# EasyEDA schematic voltage_regulator.json
TITLE: Voltage Regulator Using 7805; REV: 1.0; Date: 2022-07-14; Sheet: 1/1; Company: Symbiosis Institute of Technology
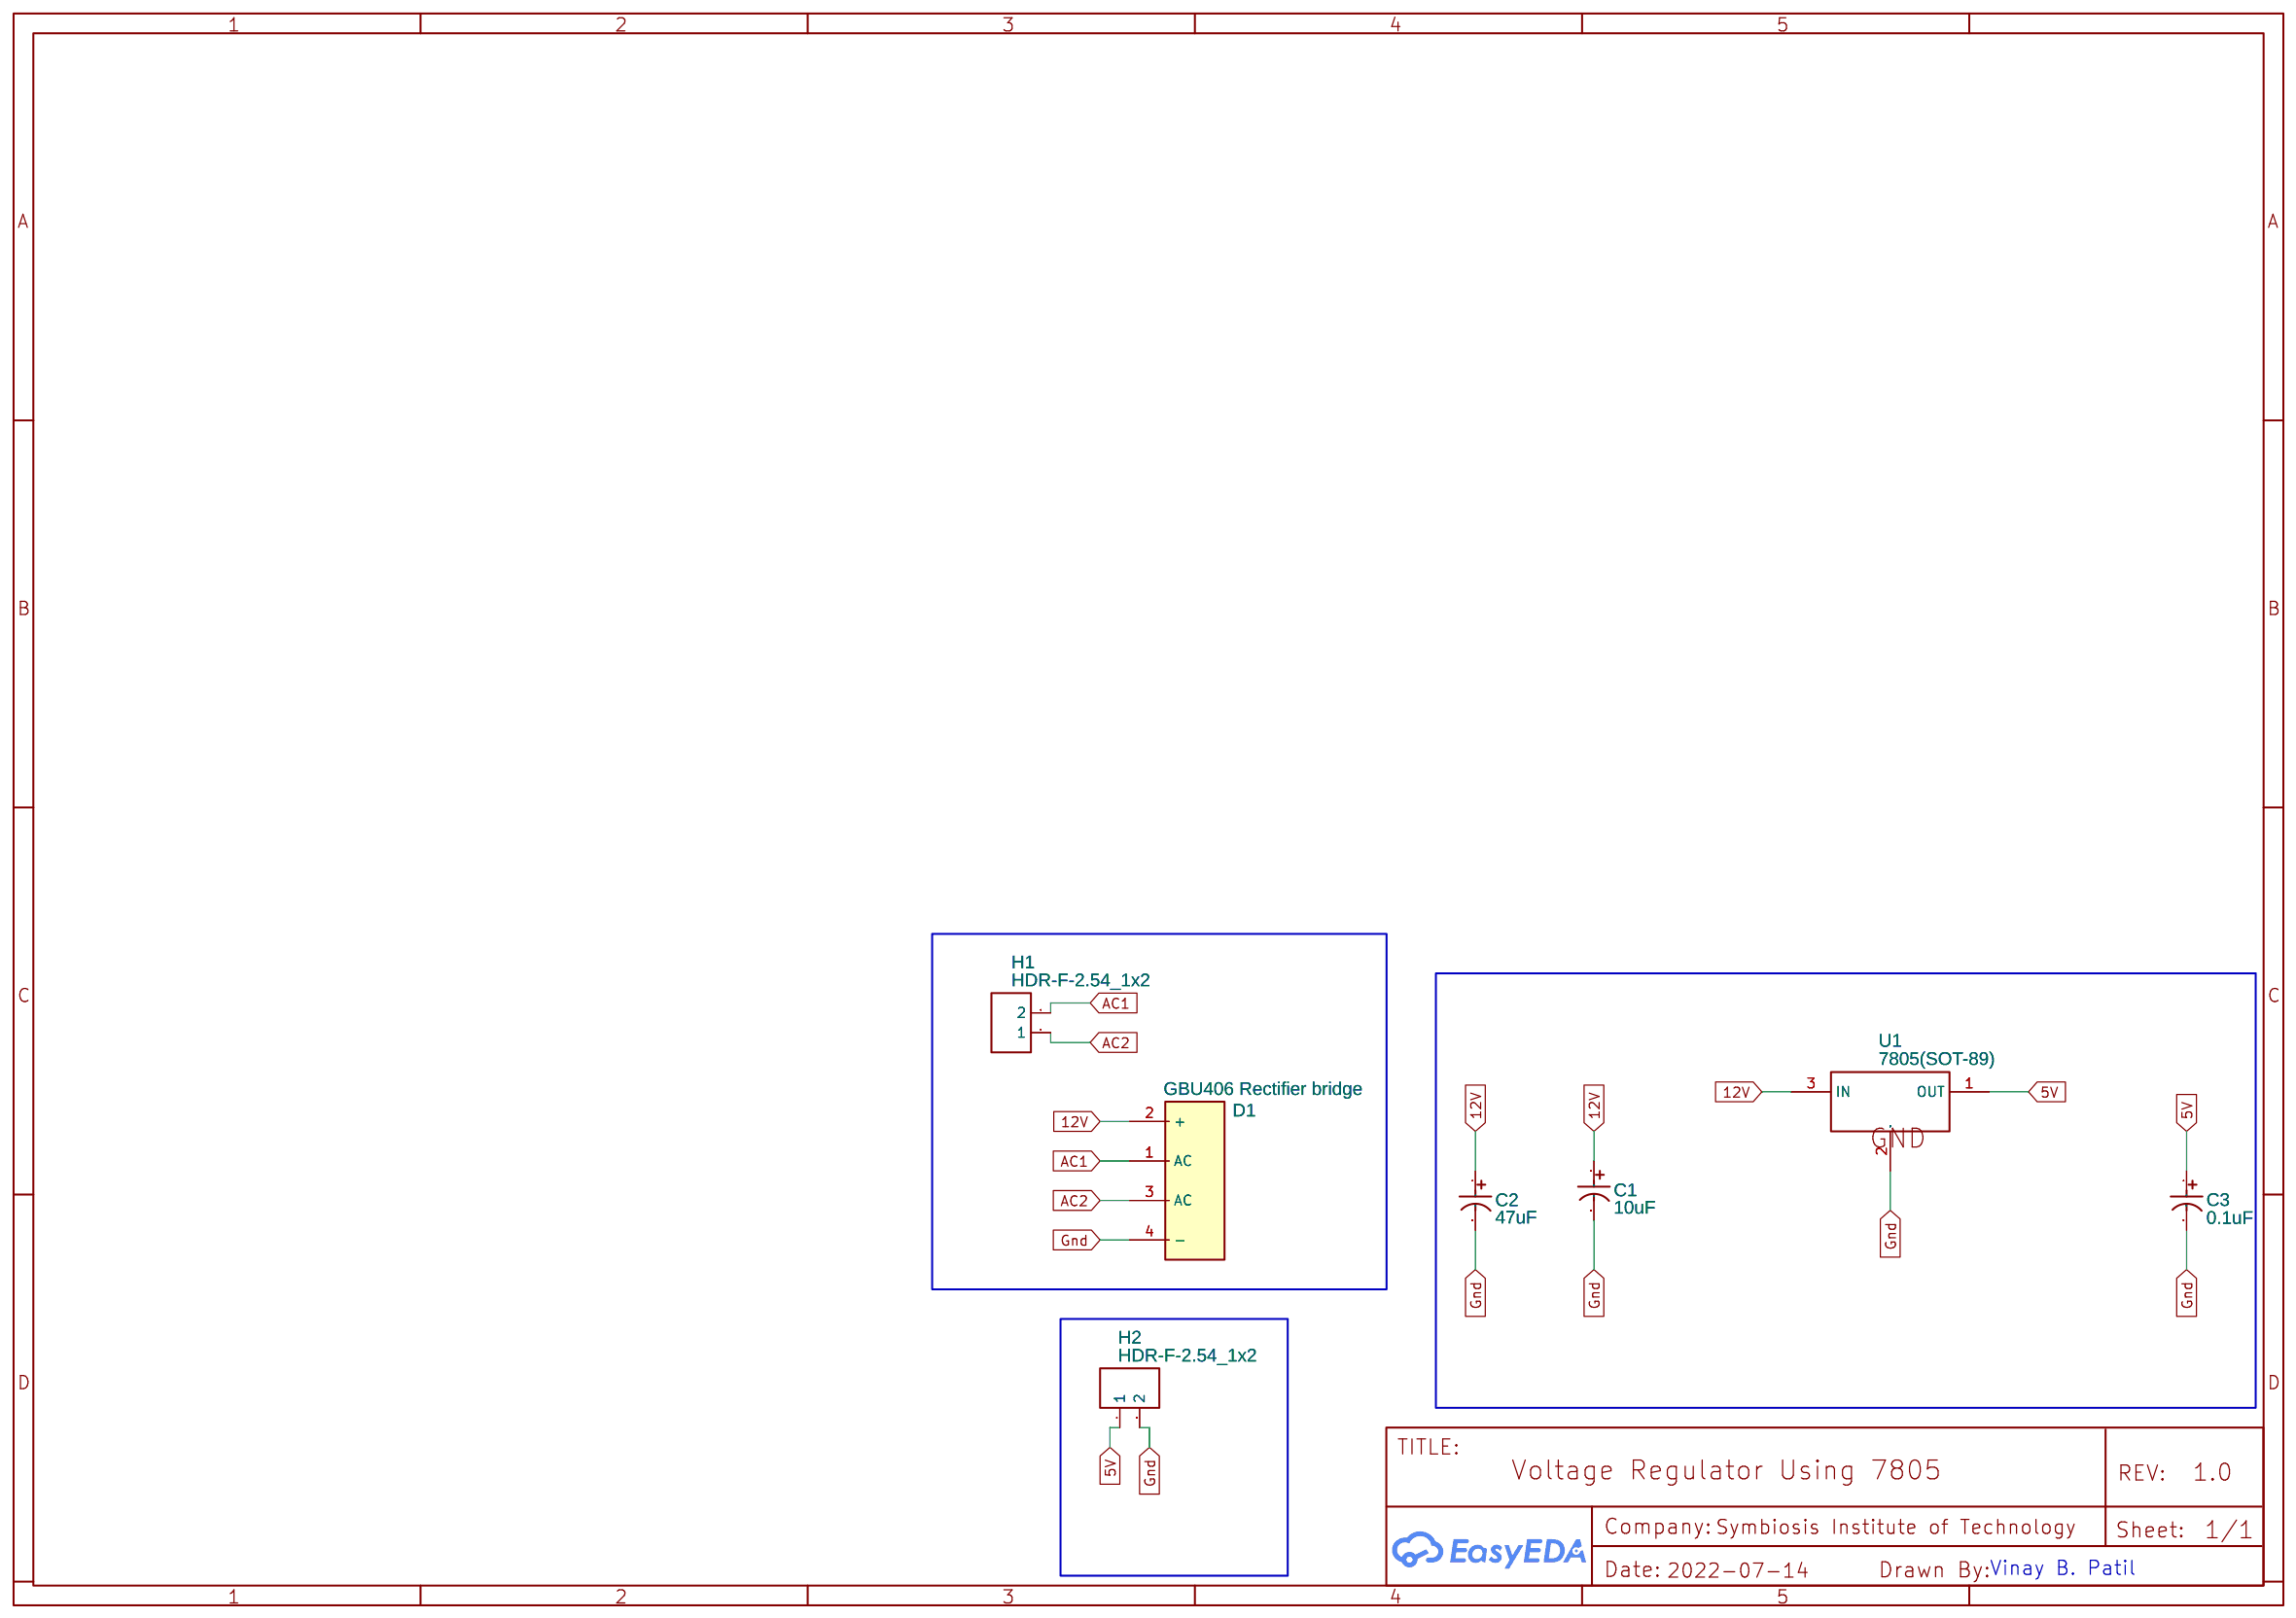
[diagram p0: schematic sheet]

## Parts
C1  10uF  [CAP-TH_BD5.0-P2.00-D0.8-FD]
C2  47uF  [CAP-TH_BD5.0-P2.00-D0.8-FD]
C3  0.1uF  [CAP-TH_BD5.0-P2.00-D0.8-FD]
D1  GBU406 Rectifier bridge  [DIO-BG-TH_GBU406]
H1  HDR-F-2.54_1x2  [HDR-F-2.54_1X2]
H2  HDR-F-2.54_1x2  [HDR-F-2.54_1X2]
U1  7805(SOT-89)  [SOT-89-3_L4.5-W2.5-P1.50-LS4.2-BR]

## Library data of the parts
C1 = 10uF 16V 5*11: Supplier: LCSC; Manufacturer: ValuePro; Supplier Part: C43799; JLCPCB Part Class: Extended Part
C2 = 47uF 16V Aluminum electrolytic capacitors: Supplier: LCSC; Manufacturer: ValuePro; Supplier Part: C22320; JLCPCB Part Class: Extended Part
C3 = 0.1UF 50V: Supplier: LCSC; Manufacturer: ValuePro; Supplier Part: C28061; JLCPCB Part Class: Extended Part
D1 = GBU406 Rectifier bridge: Supplier: LCSC; Manufacturer: MDD; Supplier Part: C13432; JLCPCB Part Class: Extended Part
H1 H2 = HDR-F-2.54_1x2: Supplier Part: C49661; Supplier: LCSC; Contributor: LCEDA_Lib
U1 = 7805(SOT-89): Supplier: LCSC; Manufacturer: CJ; Manufacturer Part: CJ78L05; image: //image.lceda.cn/szlcsc/C2079.jpg; Supplier Part: C2079; Paste Type: expand; Contributor: LCEDA_Lib

## Nets
5V: C3.1 H2.1 U1.1(OUT)
12V: C1.1 C2.1 D1.2(+) U1.3(IN)
Gnd: C1.2 C2.2 C3.2 D1.4(-) H2.2 U1.2(GND)
AC1: D1.1(AC) H1.2
AC2: D1.3(AC) H1.1

## Notes on the sheet
- Vinay B. Patil
